# EAGLE schematic IV6 nixie board (EAGLE 6.3)
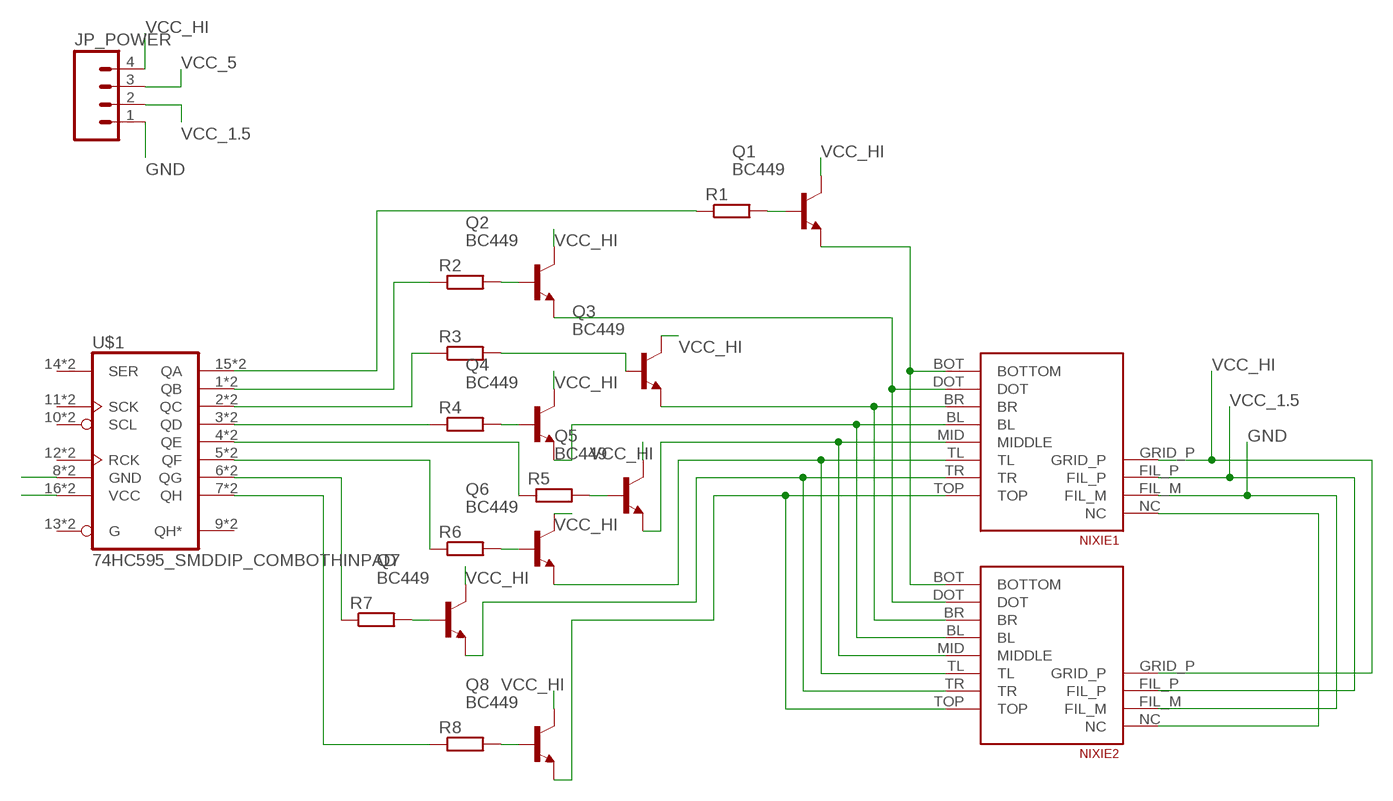
[diagram p0: schematic, sheet 1]

## Parts
JP_POWER  M04PTH  [1X04]
NIXIE1  IV6_NUMITRONLARGE  [IV6_NUMITRON_PAC_LARGE]
NIXIE2  IV6_NUMITRONLARGE  [IV6_NUMITRON_PAC_LARGE]
Q1  BC449  [TO92-EBC]
Q2  BC449  [TO92-EBC]
Q3  BC449  [TO92-EBC]
Q4  BC449  [TO92-EBC]
Q5  BC449  [TO92-EBC]
Q6  BC449  [TO92-EBC]
Q7  BC449  [TO92-EBC]
Q8  BC449  [TO92-EBC]
R1  R-EU_0204/7  [0204/7]
R2  R-EU_0204/7  [0204/7]
R3  R-EU_0204/7  [0204/7]
R4  R-EU_0204/7  [0204/7]
R5  R-EU_0204/7  [0204/7]
R6  R-EU_0204/7  [0204/7]
R7  R-EU_0204/7  [0204/7]
R8  R-EU_0204/7  [0204/7]
U$1  74HC595_SMDDIP_COMBOTHINPAD  [DIL16_SO16_PAC2]

## Nets
GND: JP_POWER.1 NIXIE1.FIL_M NIXIE2.FIL_M U$1.8(GND) U$1.S8(GND)
N$1: NIXIE1.BOT(BOTTOM) NIXIE2.BOT(BOTTOM) Q1.E
N$2: NIXIE1.DOT NIXIE2.DOT Q2.E
N$3: NIXIE1.BR NIXIE2.BR Q3.E
N$4: NIXIE1.BL NIXIE2.BL Q4.E
N$5: NIXIE1.MID(MIDDLE) NIXIE2.MID(MIDDLE) Q5.E
N$6: NIXIE1.TL NIXIE2.TL Q6.E
N$7: NIXIE1.TR NIXIE2.TR Q7.E
N$8: NIXIE1.TOP NIXIE2.TOP Q8.E
N$12: NIXIE1.NC NIXIE2.NC
N$13: R1.1 U$1.15(QA) U$1.S15(QA)
N$14: Q1.B R1.2
N$15: R2.1 U$1.1(QB) U$1.S1(QB)
N$16: Q2.B R2.2
N$17: R3.1 U$1.2(QC) U$1.S2(QC)
N$18: Q3.B R3.2
N$19: R4.1 U$1.3(QD) U$1.S3(QD)
N$20: Q4.B R4.2
N$22: R5.1 U$1.4(QE) U$1.S4(QE)
N$23: Q5.B R5.2
N$25: R6.1 U$1.5(QF) U$1.S5(QF)
N$26: Q6.B R6.2
N$28: R7.1 U$1.6(QG) U$1.S6(QG)
N$29: Q7.B R7.2
N$31: R8.1 U$1.7(QH) U$1.S7(QH)
N$32: Q8.B R8.2
VCC_1.5: JP_POWER.2 NIXIE1.FIL_P NIXIE2.FIL_P
VCC_5: JP_POWER.3 U$1.16(VCC) U$1.S16(VCC)
VCC_HI: JP_POWER.4 NIXIE1.GRID_P NIXIE2.GRID_P Q1.C Q2.C Q3.C Q4.C Q5.C Q6.C Q7.C Q8.C
Unconnected: U$1.9(QH*) U$1.10(SCL) U$1.11(SCK) U$1.12(RCK) U$1.13(G) U$1.14(SER) U$1.S9(QH*) U$1.S10(SCL) U$1.S11(SCK) U$1.S12(RCK) U$1.S13(G) U$1.S14(SER)

## Library data of the parts
JP_POWER = SparkFun-Connectors:M04: Header 4 Standard 4-pin 0.1" header. Use with straight break away headers (SKU : PRT-00116), right angle break away headers (PRT-00553), swiss pins (PRT-00743), machine pins (PRT-00117), and female headers (PRT-00115). Molex polarized connector foot print use with SKU : PRT-08231 with associated crimp pins and housings. 1MM SMD Version SKU: PRT-10208
NIXIE1 NIXIE2 = kalshagar:IV6_NUMITRON: Regular version with small footprint
Q1-Q8 = transistor-npn:BC449*: NPN Transistor
R1-R8 = resistor:R-EU_: RESISTOR, European symbol
U$1 = kalshagar:74HC595_SMDDIP_COMBO